# Altium project Archimajor.PrjPcb
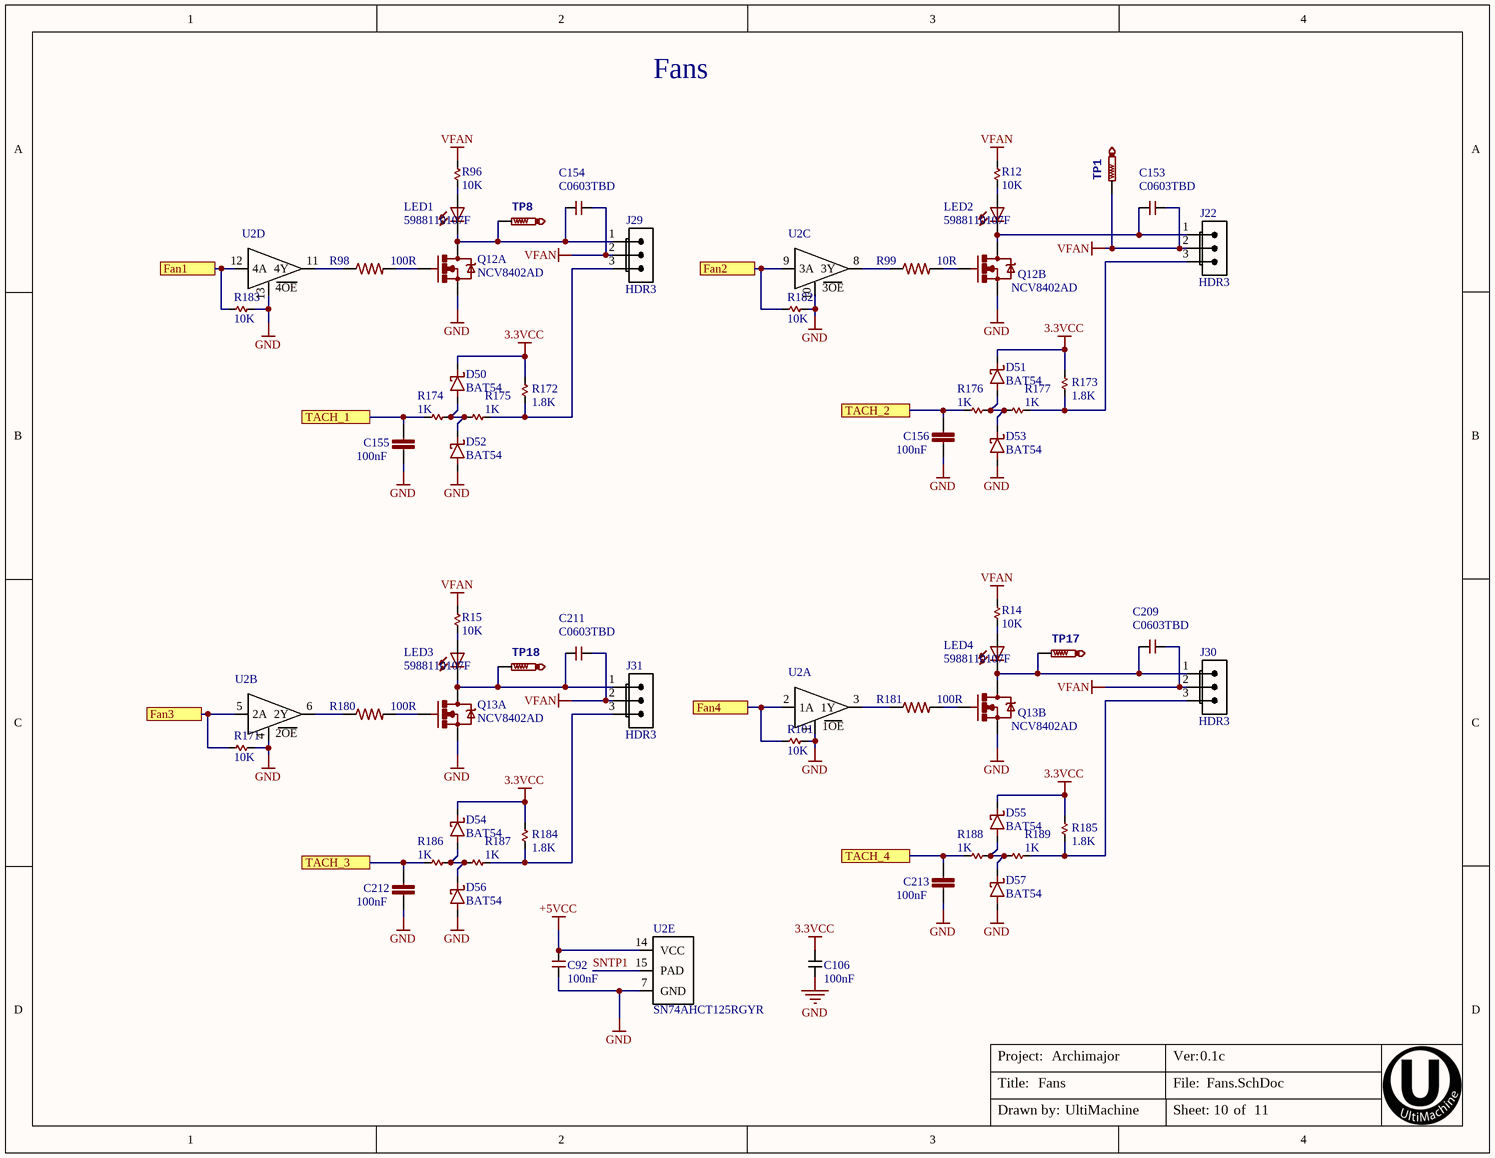
[diagram p0: Fans.SchDoc]
projectBoardVersion: 0.1c; projectDesigner: UltiMachine; projectdocumentNumber: .; projectDocumentRevision: a; projectTitle: Archimajor; projectVersion: 0.1c
2 sheets, 84 parts. Net scope: flat (ports and power ports of the same name join across sheets).
Board file: Archimajor.PcbDoc
Sheets:
  Fans.SchDoc
  Thermistors.SchDoc

## Sheet Fans.SchDoc: Fans
size Letter; DocumentNumber: 10; SheetNumber: 10; SheetTotal: 11

### Parts
C92  100nF  [C0402]
C106  100nF  [C0201 Large Pads]
C153  C0603TBD  [C0603]
C154  C0603TBD  [C0603]
C155  100nF  [C0402]
C156  100nF  [C0402]
C209  C0603TBD  [C0603]
C211  C0603TBD  [C0603]
C212  100nF  [C0402]
C213  100nF  [C0402]
D50  BAT54  [SOD523_IPC]
D51  BAT54  [SOD523_IPC]
D52  BAT54  [SOD523_IPC]
D53  BAT54  [SOD523_IPC]
D54  BAT54  [SOD523_IPC]
D55  BAT54  [SOD523_IPC]
D56  BAT54  [SOD523_IPC]
D57  BAT54  [SOD523_IPC]
J22  value HDR3  [70543-02 PIN-IN-PASTE]  (hidden comment: Molex 70543-03)
J29  value HDR3  [70543-02 PIN-IN-PASTE]  (hidden comment: Molex 70543-03)
J30  value HDR3  [70543-02 PIN-IN-PASTE]  (hidden comment: Molex 70543-03)
J31  value HDR3  [70543-02 PIN-IN-PASTE]  (hidden comment: Molex 70543-03)
LED1  RED  [LED2012120]  (value not drawn)
LED2  RED  [LED2012120]  (value not drawn)
LED3  RED  [LED2012120]  (value not drawn)
LED4  RED  [LED2012120]  (value not drawn)
Q12  NCV8402AD  [NCV8402AD-SOIC8]  (parts A,B of 2)
Q13  NCV8402AD  [NCV8402AD-SOIC8]  (parts A,B of 2)
R12  10K  [R0402]
R14  10K  [R0402]
R15  10K  [R0402]
R96  10K  [R0402]
R98  100R  [R0402]
R99  10R  [R0402]
R101  10K  [R0402]
R171  10K  [R0402]
R172  1.8K  [R0402]
R173  1.8K  [R0402]
R174  1K  [R0402]
R175  1K  [R0402]
R176  1K  [R0402]
R177  1K  [R0402]
R180  100R  [R0402]
R181  100R  [R0402]
R182  10K  [R0402]
R183  10K  [R0402]
R184  1.8K  [R0402]
R185  1.8K  [R0402]
R186  1K  [R0402]
R187  1K  [R0402]
R188  1K  [R0402]
R189  1K  [R0402]
TP1  TestPoint  [TP1-27]  (value not drawn)  (no BOM)
TP8  TestPoint  [TP1-27]  (value not drawn)  (no BOM)
TP17  TestPoint  [TP1-27]  (value not drawn)  (no BOM)
TP18  TestPoint  [TP1-27]  (value not drawn)  (no BOM)
U2  SN74AHCT125RGYR  [QFN50P350X350X100_RGY_S-PVQFN-N14]  (value not drawn)  (parts A,B,C,D,E of 5)

### Ports
Fan1, Fan2, Fan3, Fan4, TACH_1, TACH_2, TACH_3, TACH_4

### Nets
3.3VCC: C106.2 D50.K D51.K D54.K D55.K R172.2 R173.2 R184.2 R185.2
+5VCC: C92.2 U2.14(VCC)
GND: C92.1 C106.1 C155.2 C156.2 C212.2 C213.2 D52.A D56.A D57.A Q12.1(S) Q12.3(S) Q13.1(S) Q13.3(S) R101.2 R171.2 R182.2 R183.2 U2.1(1OE) U2.4(2OE) U2.7(GND) U2.10(3OE) U2.13(4OE)
VFAN: C153.1 C154.1 C209.1 C211.1 J22.2(S) J29.2(S) J30.2(S) J31.2(S) R12.2 R14.2 R15.2 R96.2 TP1.TP
Fan1: R183.1 U2.12(4A) ; port Fan1
Fan2: R182.1 U2.9(3A) ; port Fan2
Fan3: R171.1 U2.5(2A) ; port Fan3
Fan4: R101.1 U2.2(1A) ; port Fan4
SNTP1: U2.15(PAD)
TACH_1: C155.1 R174.1 ; port TACH_1
TACH_2: C156.1 R176.1 ; port TACH_2
TACH_3: C212.1 R186.1 ; port TACH_3
TACH_4: C213.1 R188.1 ; port TACH_4
NetC153_2: C153.2 J22.1(S) LED2.C Q12.5(D)
NetC154_2: C154.2 J29.1(S) LED1.C Q12.7(D) TP8.TP
NetC209_2: C209.2 J30.1(S) LED4.C Q13.5(D) TP17.TP
NetC211_2: C211.2 J31.1(S) LED3.C Q13.7(D) TP18.TP
NetD50_A: D50.A D52.K R174.2 R175.1
NetD51_A: D51.A D53.K R176.2 R177.1
NetD54_A: D54.A D56.K R186.2 R187.1
NetD55_A: D55.A D57.K R188.2 R189.1
NetJ22_3: J22.3(S) R173.1 R177.2
NetJ29_3: J29.3(S) R172.1 R175.2
NetJ30_3: J30.3(S) R185.1 R189.2
NetJ31_3: J31.3(S) R184.1 R187.2
NetLED1_A: LED1.A R96.1
NetLED2_A: LED2.A R12.1
NetLED3_A: LED3.A R15.1
NetLED4_A: LED4.A R14.1
NetQ12_2: Q12.2(G) R98.2
NetQ12_4: Q12.4(G) R99.2
NetQ13_2: Q13.2(G) R180.2
NetQ13_4: Q13.4(G) R181.2
NetR98_1: R98.1 U2.11(4Y)
NetR99_1: R99.1 U2.8(3Y)
NetR180_1: R180.1 U2.6(2Y)
NetR181_1: R181.1 U2.3(1Y)

Not connected (* = marked no-connect by the designer): D53 A

### Notes on the sheet
- Fans
- Labels drawn without touching a wire or pin: GND
- Title:
- Project:
- File:
- Ver:
- Drawn by:
- Sheet:
- of

### Library data of the parts
C92 = 100nF 0402 16V X7R: CAP CER 0402 100nF 16V 10% X7R; MANUFACTURER: Murata; MANUFACTURER #: GRM155R71C104KA88D; PART DESCRIPTION: 0.10µF ±10% 16V Ceramic Capacitor X7R 0402 (1005 Metric); VALUE: 100nF; DISTRIBUTOR #: 490-3261-2-ND; DISTRIBUTOR: Digikey; PART: GRM155R71C104KA88D; TOLERANCE: 10%; EE_SPEC: 16V
C106 = 100nF 6.3V X5R 0201: CAP CER 0.1UF 6.3V 10% X5R 0201; PART: CL03A104KQ3NNNC; MANUFACTURER: Samsung; MANUFACTURER #: CL03A104KQ3NNNC; DISTRIBUTOR: DIGI-KEY; DISTRIBUTOR #: 1276-1013-1-ND; TOLERANCE: 10%; VOLTAGE: 6.3V
C153 C209 C211 = C0603TBD: Capacitor Non Polarized; MANUFACTURER #: DNI-C0603TBD; VALUE: C0603TBD; DNI: DNI; PART: DNI-C0603TBD
C154 = C0603TBD: Capacitor Non Polarized; MANUFACTURER #: DNI-C0603TBD; TOLERANCE: 5%; VALUE: C0603TBD; DNI: DNI; PART: DNI-C0603TBD
C155 C156 C212 C213 = GRM155R71C104KA88D: CAP CER 0402 100nF 16V 10% X7R; Manufacturer: Murata; Part Description: 0.10µF ±10% 16V Ceramic Capacitor X7R 0402 (1005 Metric); EE_SPEC: 100nF 16V X7R 0402; Tolerance: +/- 10%; VALUE: 100nF; MANUFACTURER #: GRM155R71C104KA88D; DISTRIBUTOR #: 490-3261-2-ND; DISTRIBUTOR: Digi-Key; PART: GRM155R71C104KA88D
D50-D57 = BAT54WX: DIODE SCHOTTKY 30V 200MA SOD523; MANUFACTURER: Diodes Incorporated; MANUFACTURER #: BAT54WX-TP; PART DESCRIPTION: Diode Schottky 30V 200mA (DC) Surface Mount SOD-523; TOLERANCE: -NA-; VALUE: BAT54; DISTRIBUTOR #: BAT54WX-TPTR-ND; DISTRIBUTOR: Digikey; EE_SPEC: 30V 200mA; PART: BAT54WX-TP
J22 J29-J31 = CONN 3POS VERT 0.1" SHRD LOCKING PIP: 3 Positions Header, Shrouded Connector 0.100" (2.54mm) Through Hole Gold - Pin in Paste; MANUFACTURER #: 0705430002; TOLERANCE: -NA-; MANUFACTURER: Molex; DISTRIBUTOR #: WM4801-ND; DISTRIBUTOR: Digikey; PART: 0705430002; PART DESCRIPTION: 3 Positions Header, Shrouded Connector 0.100" (2.54mm) Through Hole Gold; EE_SPEC: -NA-
LED1-LED4 = 5988110107F: LED 0805 Red; Manufacturer: Dialight; Part Description: Red 635nm LED Indication - Discrete 2.2V 0805 (2012 Metric); EE_SPEC: 2.2V 0.02A; Tolerance: NA; VALUE: RED; PART: 5988110107F; DISTRIBUTOR #: 350-2038-2-ND; DISTRIBUTOR: Digi-Key; MANUFACTURER #: 5988110107F
R12 R14 R15 R96 R101 R171 R182 R183 = 10k 1% 0402: RES SMD 10K OHM 1% 1/16W 0402; MANUFACTURER: Yageo; MANUFACTURER #: RC0402FR-0710KP; PART DESCRIPTION: 10k Ohm ±1% 0.063W, 1/16W Chip Resistor 0402 (1005 Metric) Moisture Resistant Thick Film; VALUE: 10K; DISTRIBUTOR #: YAG1249TR-ND; DISTRIBUTOR: Digikey; PART: RC0402FR-0710KP; TOLERANCE: 1%; EE_SPEC: 1/16W
R98 R180 R181 = RES 100R 0402 1%: RES SMD 100 OHM 1% 1/16W 0402; MANUFACTURER: Yageo; MANUFACTURER #: RC0402FR-07100RL; PART DESCRIPTION: 100 Ohm ±1% 0.063W, 1/16W Chip Resistor 0402 (1005 Metric) Moisture Resistant Thick Film; EE_SPEC: 100R 1% 0402; VALUE: 100R; DISTRIBUTOR #: 311-100LRTR-ND; DISTRIBUTOR: Digi-Key; PART: RC0402FR-07100RL; TOLERANCE: 1%
R99 = RES 100R 0402 1%: RES SMD 100 OHM 1% 1/16W 0402; MANUFACTURER: Yageo; MANUFACTURER #: RC0402FR-0710RL; PART DESCRIPTION: 10 Ohm ±1% 0.063W, 1/16W Chip Resistor 0402 (1005 Metric) Moisture Resistant Thick Film; EE_SPEC: 10R 1% 0402; VALUE: 10R; DISTRIBUTOR #: 311-100LRTR-ND; DISTRIBUTOR: Digi-Key; PART: RC0402FR-0710RL; TOLERANCE: 1%
R172 R173 R184 R185 = RC0402FR-071K8L: RES SMD 1.8K OHM 1% 1/16W 0402; Manufacturer: Yageo; Part Description: 1.8k Ohm ±1% 0.063W, 1/16W Chip Resistor 0402 (1005 Metric) Moisture Resistant Thick Film; EE_SPEC: 1.8k 1% 0402; Tolerance: +/- 1%; VALUE: 1.8K; MANUFACTURER #: RC0402FR-071K8L; DISTRIBUTOR #: 311-1.80KLRTR-ND; DISTRIBUTOR: Digi-Key; PART: RC0402FR-071K8L
R174-R177 R186-R189 = RC0402FR-071KL: RES SMD 1K OHM 1% 1/16W 0402; Manufacturer: Yageo; Part Description: 1k Ohm ±1% 0.063W, 1/16W Chip Resistor 0402 (1005 Metric) Moisture Resistant Thick Film; EE_SPEC: 1k 1% 0402; Tolerance: +/- 1%; VALUE: 1K; MANUFACTURER #: RC0402FR-071KL; DISTRIBUTOR #: 311-1.00KLRTR-ND; DISTRIBUTOR: Digi-Key; PART: RC0402FR-071KL
TP1 TP8 TP17 TP18 = TestPoint: Test Point
U2 = SN74AHCT125: Quadruple Bus Buffer Gates With 3-State Outputs 14-VQFN -40 to 125; MANUFACTURER: Texas Instruments; PART DESCRIPTION: Buffer, Non-Inverting 4 Element 1 Bit per Element Push-Pull Output 14-VQFN (3.5x3.5); TOLERANCE: -NA-; VALUE: Tri-State Buffer; EE_SPEC: 5V 8mA; MANUFACTURER #: SN74AHCT125RGYR; DISTRIBUTOR #: 296-13910-2-ND; DISTRIBUTOR: Digikey; PART: SN74AHCT125RGYR

## Sheet Thermistors.SchDoc: Thermistors
size Letter; DocumentNumber: 7; SheetNumber: 7; SheetTotal: 11
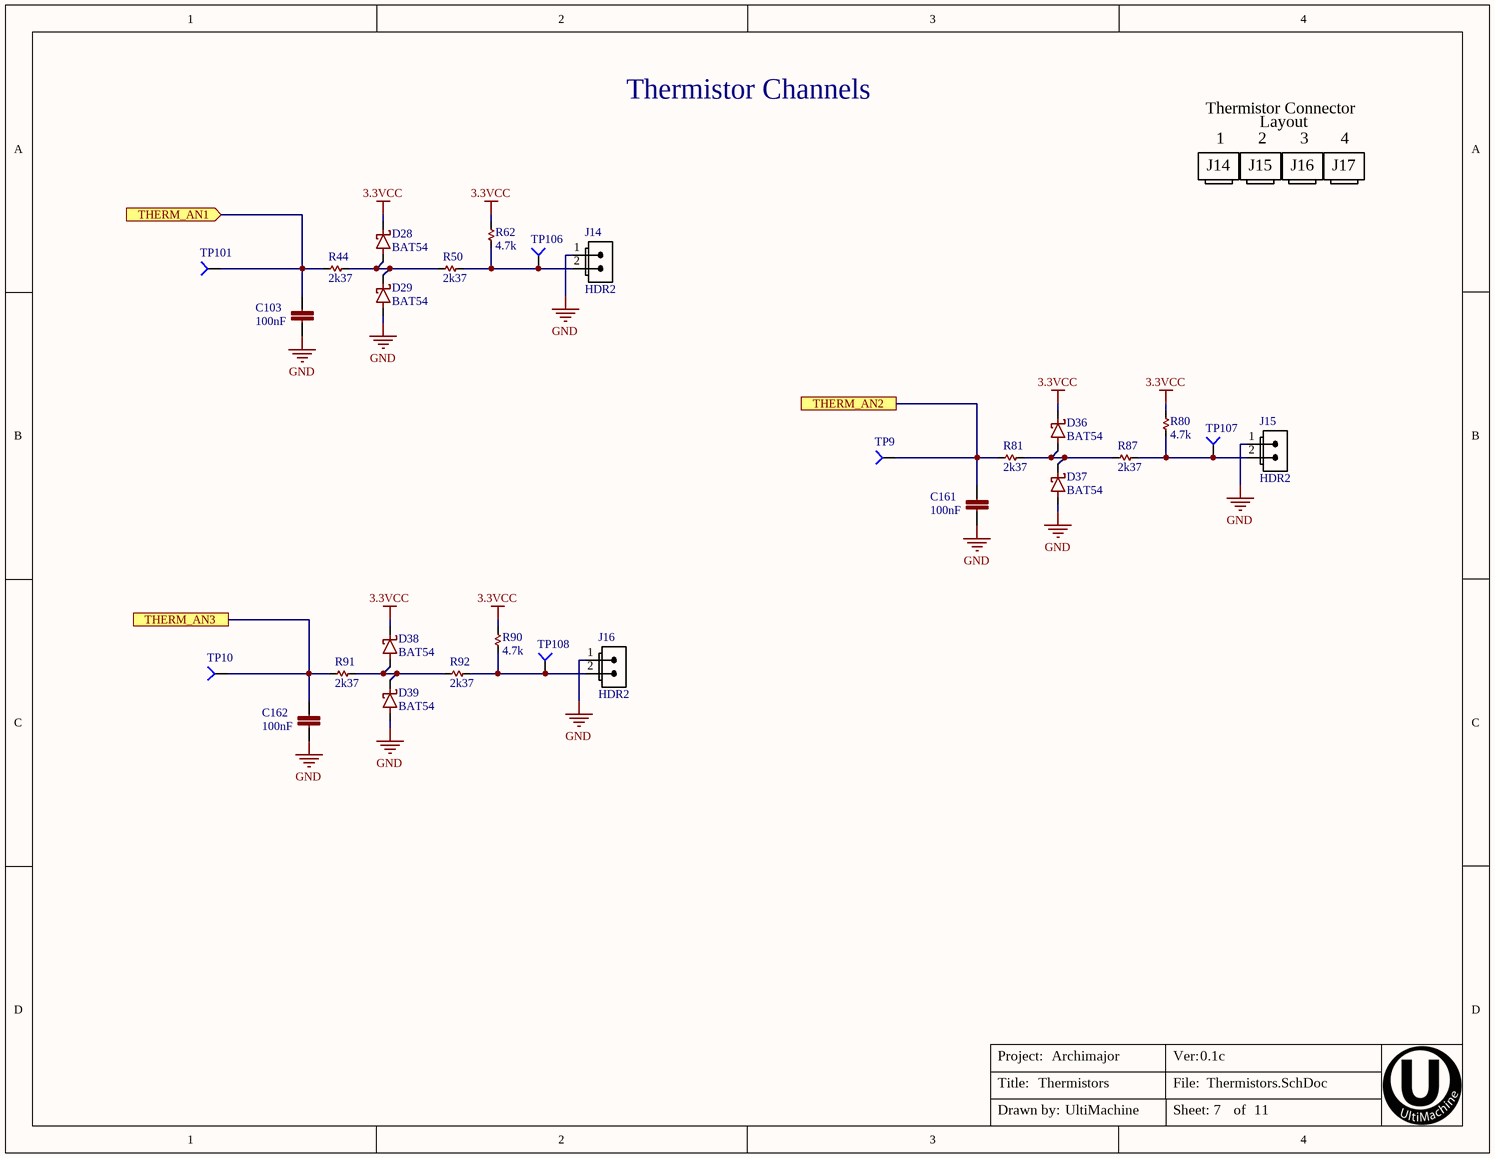
[diagram p1: Thermistors.SchDoc]

### Parts
C103  100nF  [C0402]
C161  100nF  [C0402]
C162  100nF  [C0402]
D28  BAT54  [SOD523_IPC]
D29  BAT54  [SOD523_IPC]
D36  BAT54  [SOD523_IPC]
D37  BAT54  [SOD523_IPC]
D38  BAT54  [SOD523_IPC]
D39  BAT54  [SOD523_IPC]
J14  value HDR2  [70543-01 PIN-IN-PASTE]  (hidden comment: CONN 2PIN VERT 0.1" SHRD LOCKING PIP)
J15  value HDR2  [70543-01 PIN-IN-PASTE]  (hidden comment: CONN 2PIN VERT 0.1" SHRD LOCKING PIP)
J16  value HDR2  [70543-01 PIN-IN-PASTE]  (hidden comment: CONN 2PIN VERT 0.1" SHRD LOCKING PIP)
R44  2k37  [R0402]
R50  2k37  [R0402]
R62  4.7k  [R0402]
R80  4.7k  [R0402]
R81  2k37  [R0402]
R87  2k37  [R0402]
R90  4.7k  [R0402]
R91  2k37  [R0402]
R92  2k37  [R0402]
TP9  TP4  [TP-2]  (value not drawn)  (no BOM)
TP10  TP4  [TP-2]  (value not drawn)  (no BOM)
TP101  TP4  [TP-2]  (value not drawn)  (no BOM)
TP106  TP4  [TP-2]  (value not drawn)  (no BOM)
TP107  TP4  [TP-2]  (value not drawn)  (no BOM)
TP108  TP4  [TP-2]  (value not drawn)  (no BOM)

### Ports
THERM_AN1 (in), THERM_AN2, THERM_AN3

### Nets
3.3VCC: D28.K D36.K D38.K R62.2 R80.2 R90.2
GND: C103.2 C161.2 C162.2 D29.A D37.A D39.A J14.1(S) J15.1(S) J16.1(S)
THERM_AN1: C103.1 R44.1 TP101.1 ; port THERM_AN1
THERM_AN2: C161.1 R81.1 TP9.1 ; port THERM_AN2
THERM_AN3: C162.1 R91.1 TP10.1 ; port THERM_AN3
NetD28_A: D28.A D29.K R44.2 R50.1
NetD36_A: D36.A D37.K R81.2 R87.1
NetD38_A: D38.A D39.K R91.2 R92.1
NetJ14_2: J14.2(S) R50.2 R62.1 TP106.1
NetJ15_2: J15.2(S) R80.1 R87.2 TP107.1
NetJ16_2: J16.2(S) R90.1 R92.2 TP108.1

### Notes on the sheet
- Thermistor Channels
- Thermistor Connector
- 1
- 2
- Layout
- 3
- 4
- J14
- J15
- J16
- J17
- Title:
- Project:
- File:
- Ver:
- Drawn by:
- Sheet:
- of

### Library data of the parts
C103 C161 C162 = GRM155R71C104KA88D: CAP CER 0402 100nF 16V 10% X7R; MANUFACTURER: Murata; PART DESCRIPTION: 0.10µF ±10% 16V Ceramic Capacitor X7R 0402 (1005 Metric); EE_SPEC: 100nF 16V X7R 0402; VALUE: 100nF; MANUFACTURER #: GRM155R71C104KA88D; DISTRIBUTOR #: 490-3261-2-ND; DISTRIBUTOR: Digi-Key Electronics; PART: GRM155R71C104KA88D; TOLERANCE: 10%
D28 D29 D36-D39 = BAT54WX: as D50 on sheet Fans; VALUE: BAT54; DISTRIBUTOR #: BAT54WX-TPTR-ND; DISTRIBUTOR: Digi-Key Electronics; PART: BAT54WX-TP; EE_SPEC: 30V 200mA
J14-J16 = CONN 2PIN VERT 0.1" SHRD LOCKING PIP: Connector 2pos - Pin in Paste; MANUFACTURER: Molex; MANUFACTURER #: 0705430001; PART DESCRIPTION: 2 Positions Header, Shrouded Connector 0.100" (2.54mm) Through Hole Gold; TOLERANCE: -NA-; DISTRIBUTOR #: WM4800-ND; DISTRIBUTOR: Digikey; PART: 0705430001; EE_SPEC: -NA-
R44 R50 R81 R87 R91 R92 = RC0402FR-072K37L: RES SMD 2.37K OHM 1% 1/16W 0402; MANUFACTURER: Yageo; PART DESCRIPTION: 2.37k Ohm ±1% 0.063W, 1/16W Chip Resistor 0402 (1005 Metric) Moisture Resistant Thick Film; VALUE: 2k37; MANUFACTURER #: RC0402FR-072K37L; DISTRIBUTOR #: 311-2.37KLRTR-ND; DISTRIBUTOR: Digi-Key Electronics; PART: RC0402FR-072K37L; TOLERANCE: 1%; EE_SPEC: 1/16W
R62 R80 R90 = RC0402FR-074K7L: RES SMD 4.7K OHM 1% 1/16W 0402; MANUFACTURER: YAGEO; PART DESCRIPTION: 4.7k Ohm ±1% 0.063W, 1/16W Chip Resistor 0402 (1005 Metric) Moisture Resistant Thick Film; VALUE: 4.7k; MANUFACTURER #: RC0402FR-074K7L; DISTRIBUTOR #: 311-4.7KLRTR-ND; DISTRIBUTOR: Digi-Key Electronics; PART: RC0402FR-074K7L; TOLERANCE: 1%; EE_SPEC: 1/16W
TP9 TP10 TP101 TP106-TP108 = Socket: MANUFACTURER #: NOTAPART-Testpoint; PART: NOTAPART-Testpoint

## Nets that join several sheets
3.3VCC: Fans (9 pins), Thermistors (6 pins)
GND: Fans (22 pins), Thermistors (9 pins)